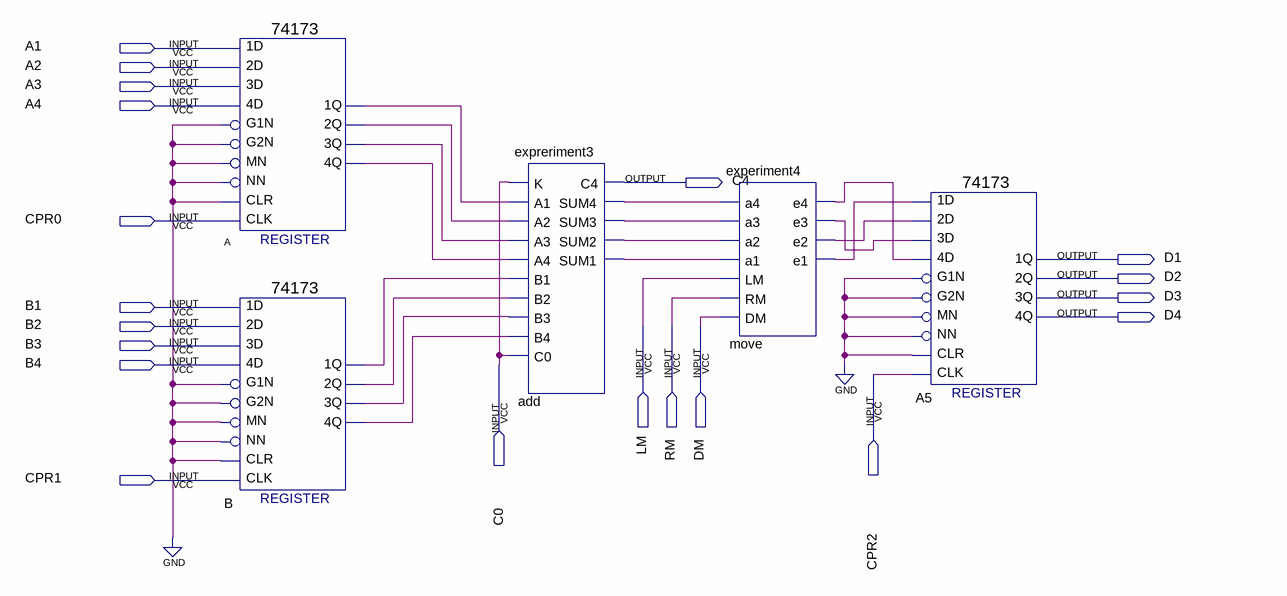
[diagram p0: schematic sheet]
// Quartus schematic experiment5.bdf as structural Verilog: 5 symbols, 20 pins
module experiment5 (
  input  A1,
  input  A2,
  input  A3,
  input  A4,
  input  CPR0,
  input  B1,
  input  B2,
  input  LM,
  input  RM,
  input  DM,
  input  B3,
  input  B4,
  input  C0,
  input  CPR2,
  input  CPR1,
  output C4,
  output D1,
  output D2,
  output D3,
  output D4
);

  wire A_1q, A_2q, A_3q, A_4q, add_sum1, add_sum2, add_sum3, add_sum4, B_1q, B_2q, B_3q, B_4q, move_e1,
       move_e2, move_e3, move_e4;

  \74173  A (
    .\3D (A3), .MN(1'b0), .\1D (A1), .\2D (A2), .\4D (A4), .G1N(1'b0), .G2N(1'b0), .NN(1'b0), .CLR(1'b0),
    .CLK(CPR0), .\3Q (A_3q), .\2Q (A_2q), .\1Q (A_1q), .\4Q (A_4q));
  \74173  B (
    .\3D (B3), .MN(1'b0), .\1D (B1), .\2D (B2), .\4D (B4), .G1N(1'b0), .G2N(1'b0), .NN(1'b0), .CLR(1'b0),
    .CLK(CPR1), .\3Q (B_3q), .\2Q (B_2q), .\1Q (B_1q), .\4Q (B_4q));
  expreriment3 add (
    .K(C0), .A1(A_1q), .A2(A_2q), .A3(A_3q), .A4(A_4q), .B1(B_1q), .B2(B_2q), .B3(B_3q), .B4(B_4q), .C0(C0),
    .C4(C4), .SUM4(add_sum4), .SUM3(add_sum3), .SUM2(add_sum2), .SUM1(add_sum1));
  experiment4 move (
    .a4(add_sum4), .a3(add_sum3), .a2(add_sum2), .a1(add_sum1), .LM(LM), .RM(RM), .DM(DM), .e4(move_e4),
    .e3(move_e3), .e2(move_e2), .e1(move_e1));
  \74173  A5 (
    .\3D (move_e3), .MN(1'b0), .\1D (move_e1), .\2D (move_e2), .\4D (move_e4), .G1N(1'b0), .G2N(1'b0),
    .NN(1'b0), .CLR(1'b0), .CLK(CPR2), .\3Q (D3), .\2Q (D2), .\1Q (D1), .\4Q (D4));
endmodule
